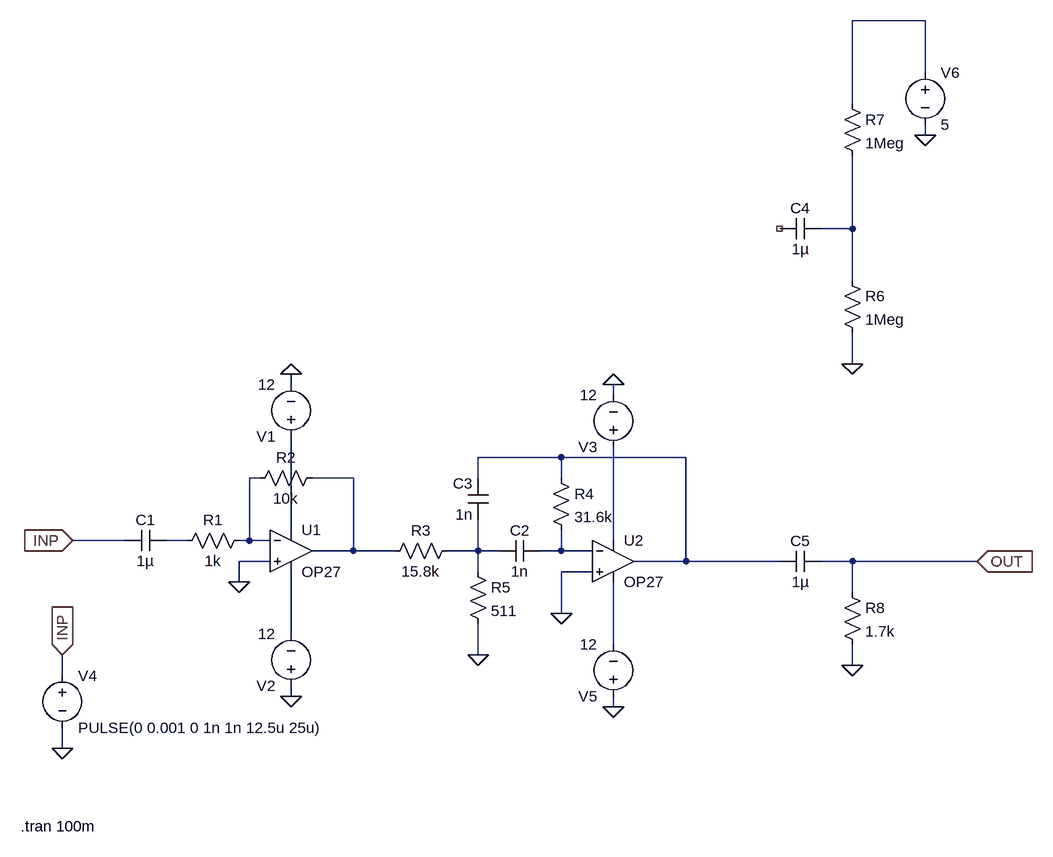
[diagram p0: schematic lna.asc]
lna.asc, the LTspice schematic file:
Version 4.1
SHEET 1 1356 680
WIRE 1168 -640 1056 -640
WIRE 1168 -560 1168 -640
WIRE 1056 -512 1056 -640
WIRE 1168 -464 1168 -480
WIRE 1056 -320 1056 -432
WIRE 1056 -320 1008 -320
WIRE 1056 -240 1056 -320
WIRE 1056 -112 1056 -160
WIRE 192 -80 192 -96
WIRE 688 -64 688 -80
WIRE 608 32 480 32
WIRE 800 32 608 32
WIRE 144 64 128 64
WIRE 288 64 224 64
WIRE 480 64 480 32
WIRE 608 64 608 32
WIRE 192 144 192 0
WIRE -64 160 -144 160
WIRE 32 160 0 160
WIRE 128 160 128 64
WIRE 128 160 112 160
WIRE 160 160 128 160
WIRE 688 160 688 16
WIRE 288 176 288 64
WIRE 288 176 224 176
WIRE 352 176 288 176
WIRE 480 176 480 128
WIRE 480 176 432 176
WIRE 512 176 480 176
WIRE 608 176 608 144
WIRE 608 176 576 176
WIRE 656 176 608 176
WIRE 160 192 112 192
WIRE 800 192 800 32
WIRE 800 192 720 192
WIRE 944 192 800 192
WIRE 1056 192 1008 192
WIRE 1248 192 1056 192
WIRE 480 208 480 176
WIRE 656 208 608 208
WIRE 112 224 112 192
WIRE 1056 240 1056 192
WIRE 608 272 608 208
WIRE 192 304 192 208
WIRE 688 320 688 224
WIRE 480 336 480 288
WIRE 1056 352 1056 320
WIRE -160 368 -160 336
WIRE 192 400 192 384
WIRE 688 416 688 400
WIRE -160 480 -160 448
FLAG 192 -96 0
FLAG -144 160 INP
IOPIN -144 160 In
FLAG 1248 192 OUT
IOPIN 1248 192 In
FLAG -160 336 INP
IOPIN -160 336 In
FLAG 112 224 0
FLAG -160 480 0
FLAG 192 400 0
FLAG 688 -80 0
FLAG 688 416 0
FLAG 608 272 0
FLAG 480 336 0
FLAG 1168 -464 0
FLAG 1056 -112 0
FLAG 1056 352 0
SYMBOL OpAmps\\OP27 192 112 R0
SYMATTR InstName U1
SYMBOL voltage 192 16 R180
WINDOW 123 0 0 Left 0
WINDOW 39 0 0 Left 0
SYMATTR InstName V1
SYMATTR Value 12
SYMBOL cap 0 144 R90
WINDOW 0 0 32 VBottom 2
WINDOW 3 32 32 VTop 2
SYMATTR InstName C1
SYMATTR Value 1µ
SYMBOL voltage -160 352 R0
WINDOW 123 0 0 Left 0
WINDOW 39 0 0 Left 0
SYMATTR InstName V4
SYMATTR Value PULSE(0 0.001 0 1n 1n 12.5u 25u)
SYMBOL res 128 144 R90
WINDOW 0 0 56 VBottom 2
WINDOW 3 32 56 VTop 2
SYMATTR InstName R1
SYMATTR Value 1k
SYMBOL res 240 48 R90
WINDOW 0 0 56 VBottom 2
WINDOW 3 32 56 VTop 2
SYMATTR InstName R2
SYMATTR Value 10k
SYMBOL voltage 192 400 R180
WINDOW 123 0 0 Left 0
WINDOW 39 0 0 Left 0
SYMATTR InstName V2
SYMATTR Value 12
SYMBOL OpAmps\\OP27 688 128 R0
SYMATTR InstName U2
SYMBOL voltage 688 32 R180
WINDOW 123 0 0 Left 0
WINDOW 39 0 0 Left 0
SYMATTR InstName V3
SYMATTR Value 12
SYMBOL voltage 688 416 R180
WINDOW 123 0 0 Left 0
WINDOW 39 0 0 Left 0
SYMATTR InstName V5
SYMATTR Value 12
SYMBOL res 448 160 R90
WINDOW 0 0 56 VBottom 2
WINDOW 3 32 56 VTop 2
SYMATTR InstName R3
SYMATTR Value 15.8k
SYMBOL cap 576 160 R90
WINDOW 0 0 32 VBottom 2
WINDOW 3 32 32 VTop 2
SYMATTR InstName C2
SYMATTR Value 1n
SYMBOL cap 496 128 R180
WINDOW 0 24 56 Left 2
WINDOW 3 24 8 Left 2
SYMATTR InstName C3
SYMATTR Value 1n
SYMBOL res 592 48 R0
SYMATTR InstName R4
SYMATTR Value 31.6k
SYMBOL res 464 192 R0
SYMATTR InstName R5
SYMATTR Value 511
SYMBOL cap 1008 -336 R90
WINDOW 0 0 32 VBottom 2
WINDOW 3 32 32 VTop 2
SYMATTR InstName C4
SYMATTR Value 1µ
SYMBOL res 1040 -256 R0
SYMATTR InstName R6
SYMATTR Value 1Meg
SYMBOL res 1040 -528 R0
SYMATTR InstName R7
SYMATTR Value 1Meg
SYMBOL voltage 1168 -576 R0
WINDOW 123 0 0 Left 0
WINDOW 39 0 0 Left 0
SYMATTR InstName V6
SYMATTR Value 5
SYMBOL cap 1008 176 R90
WINDOW 0 0 32 VBottom 2
WINDOW 3 32 32 VTop 2
SYMATTR InstName C5
SYMATTR Value 1µ
SYMBOL res 1040 224 R0
SYMATTR InstName R8
SYMATTR Value 1.7k
TEXT -224 600 Left 2 !.tran 100m

The netlist it stands for:
* lna.asc
X§U1 0 N004 N006 N011 N005 OP27  ; pins In+ In- V+ V- OUT
V1 N006 0 12
C1 N007 INP 1µ
V4 INP 0 PULSE(0 0.001 0 1n 1n 12.5u 25u)
R1 N004 N007 1k
R2 N005 N004 10k
V2 0 N011 12
X§U2 0 N010 N008 N012 N003 OP27  ; pins In+ In- V+ V- OUT
V3 N008 0 12
V5 0 N012 12
R3 N009 N005 15.8k
C2 N010 N009 1n
C3 N009 N003 1n
R4 N003 N010 31.6k
R5 N009 0 511
C4 N002 NC_01 1µ
R6 N002 0 1Meg
R7 N001 N002 1Meg
V6 N001 0 5
C5 OUT N003 1µ
R8 OUT 0 1.7k
.tran 100m
.lib ADI.lib
.backanno
.end